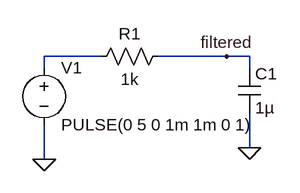
[diagram p0: schematic micro_sign.asc]
micro_sign.asc, the LTspice schematic file:
Version 4.1
SHEET 1 880 680
WIRE 32 128 -48 128
WIRE 208 128 112 128
WIRE 240 128 208 128
WIRE -48 144 -48 128
WIRE 240 144 240 128
WIRE 240 256 240 208
WIRE -48 272 -48 224
FLAG 240 256 0
FLAG 208 128 filtered
FLAG -48 272 0
SYMBOL cap 224 144 R0
SYMATTR InstName C1
SYMATTR Value 1µ
SYMBOL res 128 112 R90
WINDOW 0 0 56 VBottom 2
WINDOW 3 32 56 VTop 2
SYMATTR InstName R1
SYMATTR Value 1k
SYMBOL voltage -48 128 R0
WINDOW 123 0 0 Left 0
WINDOW 39 0 0 Left 0
SYMATTR InstName V1
SYMATTR Value PULSE(0 5 0 1m 1m 0 1)

The netlist it stands for:
* micro_sign.asc
C1 filtered 0 1µ
R1 filtered N001 1k
V1 N001 0 PULSE(0 5 0 1m 1m 0 1)
.backanno
.end